# Altium schematic sheet Sheet1.SchDoc
size A4; SheetNumber: 1; SheetTotal: 1
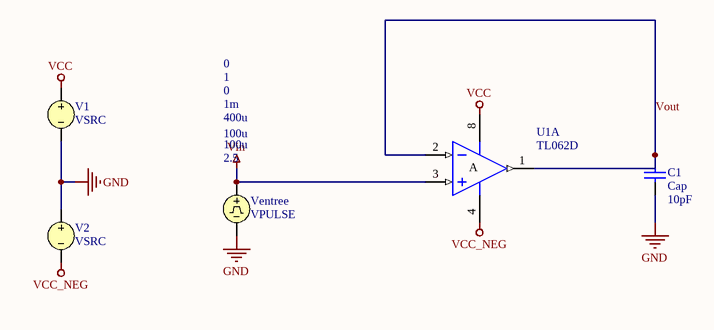
[diagram p0: Sheet1.SchDoc]

## Parts
C1  Cap  value 10pF  [RAD-0.3]
U1  TL062D  [D008_L]  (part A of 2)
V1  VSRC
V2  VSRC
Ventree  VPULSE  Pulsed Value: 2.5  Rise Time: 100u  Pulse Width: 400u  Period: 1m  DC Magnitude: 0  AC Magnitude: 1

## Nets
GND: C1.1 V1.2 V2.1 Ventree.2
VCC: U1.8(V+) V1.1
VCC_NEG: U1.4(V-) V2.2
Vin: U1.3(IN+) Ventree.1
Vout: C1.2 U1.1(OUT) U1.2(IN-)

## Notes on the sheet
- (in symbol TL062D, part A) A

## Library data of the parts
C1 = Cap: Capacitor; Published: 8-Jun-2000; LatestRevisionDate: 17-Jul-2002; LatestRevisionNote: Re-released for DXP Platform.; PackageReference: RAD-0.3; Publisher: Altium Limited; PackageDescription: Radial Cap, Thru-Hole; 2 Leads; 0.3 in Pin Spacing
U1 = TL062D: Low-Power JFET-Input Operational Amplifier; Published: 16-Jan-2001; LatestRevisionDate: 13-Apr-2006; LatestRevisionNote: IPC-7351 Footprint Added.; DatasheetVersion: Jan-1999; PackageVersion: Jan-1998; PackageReference: D008; Publisher: Altium Limited; PackageDescription: 8-Pin Small Outline Integrated Circuit 1.27 mm Pitch; Code_IPC: SOIC127P600-8; ComponentLink1Description: Manufacturer Link; ComponentLink1URL: http://www.ti.com/; ComponentLink2Description: Datasheet; ComponentLink2URL: http://www-s.ti.com/sc/ds/tl062.pdf
V1 V2 = VSRC: Voltage Source; Note: PCB Footprint - Not required; Value: 15; Published: 8-Jun-2000; LatestRevisionDate: 17-Jul-2002; LatestRevisionNote: Re-released for DXP Platform.; PackageReference: Not Applicable; Publisher: Altium Limited
Ventree = VPULSE: Pulse Voltage Source; Note: PCB Footprint - Not required; Published: 8-Jun-2000; LatestRevisionDate: 15-Nov-2004; LatestRevisionNote: Corrected Netlist.; PackageReference: Not Applicable; Publisher: Altium Limited; Initial Value: 0; Fall Time: 100u; AC Phase: 0